# Altium project Current_sence_unit.PrjPcb
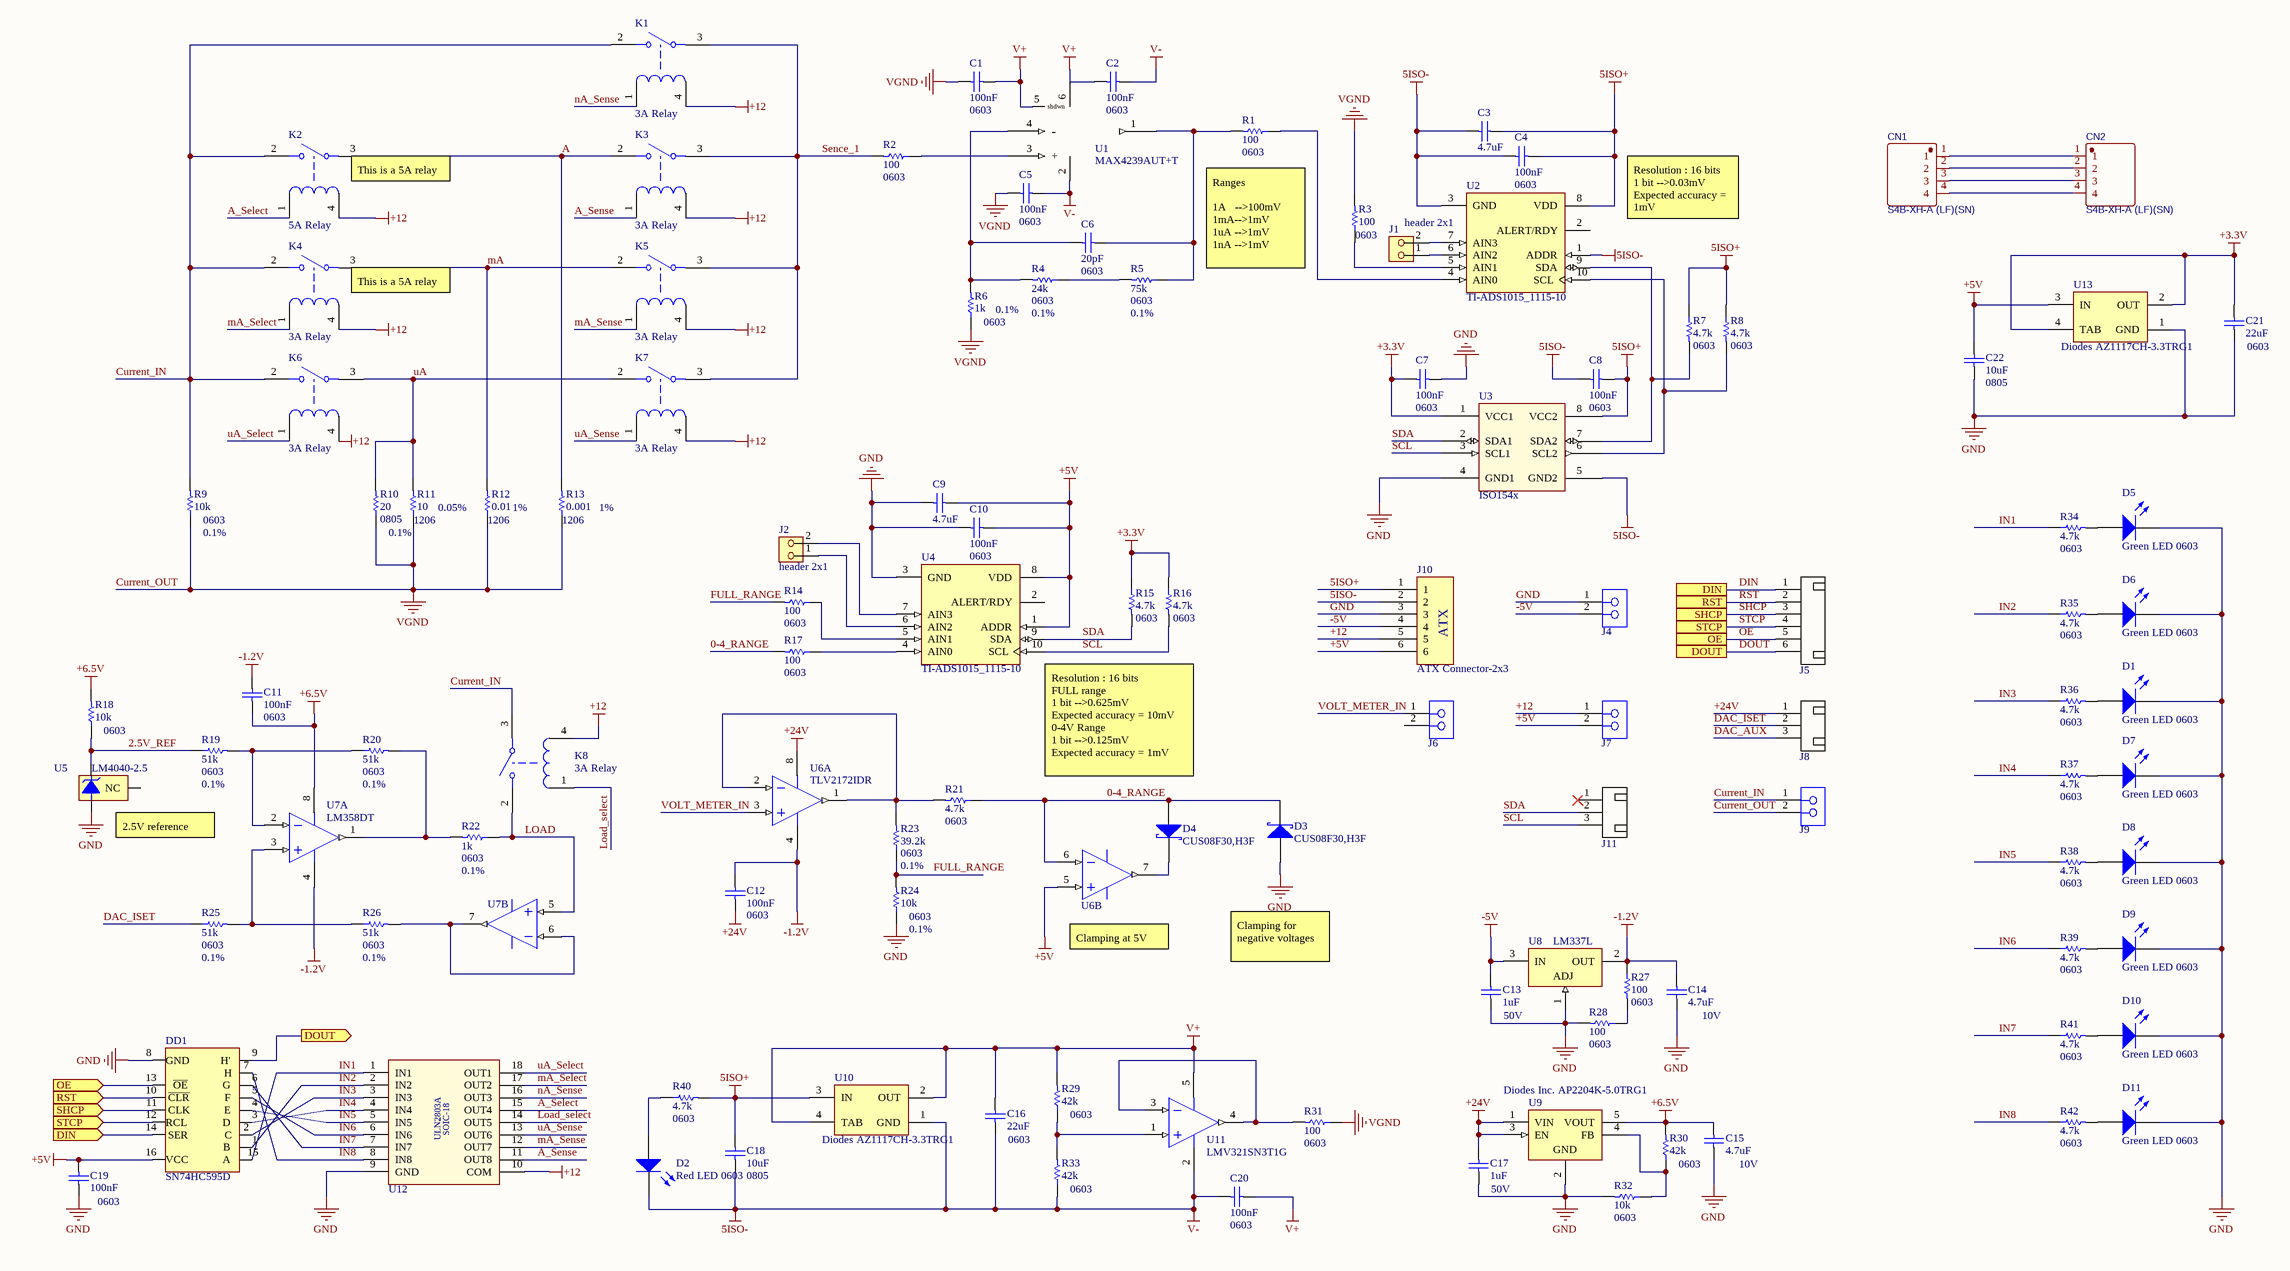
[diagram p0: Current_sence-load-volt_meter.SchDoc]
1 sheet, 109 parts. Net scope: flat (ports and power ports of the same name join across sheets).
Board file: PCB_V1.PcbDoc

## Sheet Current_sence-load-volt_meter.SchDoc
size C

### Parts
C1  100nF  Package / Case: 0603  [CAPC1608X09N]
C2  100nF  Package / Case: 0603  [CAPC1608X09N]
C3  4.7uF  [CAPC1608X09N]
C4  100nF  Package / Case: 0603  [CAPC1608X09N]
C5  100nF  Package / Case: 0603  [CAPC1608X09N]
C6  20pF  Package / Case: 0603  [CAPC1608X09N]
C7  100nF  Package / Case: 0603  [CAPC1608X09N]
C8  100nF  Package / Case: 0603  [CAPC1608X09N]
C9  4.7uF  [CAPC1608X09N]
C10  100nF  Package / Case: 0603  [CAPC1608X09N]
C11  100nF  Package / Case: 0603  [CAPC1608X09N]
C12  100nF  Package / Case: 0603  [CAPC1608X09N]
C13  1uF  Voltage-Rated: 50V  [CAPC1608X09N]
C14  4.7uF  Voltage-Rated: 10V  [CAPC1608X09N]
C15  4.7uF  Voltage-Rated: 10V  [CAPC1608X09N]
C16  22uF  Package / Case: 0603  [CAPC1608X09N]
C17  1uF  Voltage-Rated: 50V  [CAPC1608X09N]
C18  10uF  Package / Case: 0805  [C0805]
C19  100nF  Package / Case: 0603  [CAPC1608X09N]
C20  100nF  Package / Case: 0603  [CAPC1608X09N]
C21  22uF  Package / Case: 0603  [CAPC1608X09N]
C22  10uF  Package / Case: 0805  [C0805]
CN1  S4B-XH-A (LF)(SN)  [CONN-TH_S4B-XH-A (LF)(SN)]
CN2  S4B-XH-A (LF)(SN)  [CONN-TH_S4B-XH-A (LF)(SN)]
D1  Green LED 0603  [0603LED_GEN]
D2  Red LED 0603  [0603LED_GEN]
D3  CUS08F30,H3F  [PCB-7qpkjsjx5cjbarp1o0hc-1]
D4  CUS08F30,H3F  [PCB-7qpkjsjx5cjbarp1o0hc-1]
D5  Green LED 0603  [0603LED_GEN]
D6  Green LED 0603  [0603LED_GEN]
D7  Green LED 0603  [0603LED_GEN]
D8  Green LED 0603  [0603LED_GEN]
D9  Green LED 0603  [0603LED_GEN]
D10  Green LED 0603  [0603LED_GEN]
D11  Green LED 0603  [0603LED_GEN]
DD1  SN74HC595D  [PCB-72k1vk0k27b6qyyenbg0-1]
J1  header 2x1  [PCB-55llon6gpk2h6a06nz0l-1]
J2  header 2x1  [PCB-55llon6gpk2h6a06nz0l-1]
J4  DB126V-5.0-2P-GN  [PCB-kiok1jlp9o9fcwf1wwvf-1]  (value not drawn)
J5  JST S6B-XH-A  [JST S6B-XH-A]  (value not drawn)
J6  DB126V-5.0-2P-GN  [PCB-kiok1jlp9o9fcwf1wwvf-1]  (value not drawn)
J7  DB126V-5.0-2P-GN  [PCB-kiok1jlp9o9fcwf1wwvf-1]  (value not drawn)
J8  CN-1P-M-R3  [JST-S3B-XH-A(LF)(SN)_V]  (value not drawn)
J9  DB126V-5.0-2P-GN  [PCB-kiok1jlp9o9fcwf1wwvf-1]  (value not drawn)
J10  ATX Connector-2x3  [30300060]
J11  CN-1P-M-R3  [JST-S3B-XH-A(LF)(SN)_V]  (value not drawn)
K1  3A Relay  [PCB-ei6nokn2irsc2a7yt94x-1]
K2  5A Relay  [PCB-ei6nokn2irsc2a7yt94x-1]
K3  3A Relay  [PCB-ei6nokn2irsc2a7yt94x-1]
K4  3A Relay  [PCB-ei6nokn2irsc2a7yt94x-1]
K5  3A Relay  [PCB-ei6nokn2irsc2a7yt94x-1]
K6  3A Relay  [PCB-ei6nokn2irsc2a7yt94x-1]
K7  3A Relay  [PCB-ei6nokn2irsc2a7yt94x-1]
K8  3A Relay  [PCB-ei6nokn2irsc2a7yt94x-1]
R1  100  Package / Case: 0603  [gen0603-2]
R2  100  Package / Case: 0603  [gen0603-2]
R3  100  Package / Case: 0603  [gen0603-2]
R4  24k  Package / Case: 0603  Resistance Tolerance: 0.1%  [gen0603-2]
R5  75k  Package / Case: 0603  Resistance Tolerance: 0.1%  [gen0603-2]
R6  1k  Package / Case: 0603  Resistance Tolerance: 0.1%  [gen0603-2]
R7  4.7k  Package / Case: 0603  [gen0603-2]
R8  4.7k  Package / Case: 0603  [gen0603-2]
R9  10k  Package / Case: 0603  Resistance Tolerance: 0.1%  [gen0603-2]
R10  20  Package / Case: 0805  Resistance Tolerance: 0.1%  [PCB-p5gaxfzqzpvl2g018b4o-1]
R11  10  Package / Case: 1206  Resistance Tolerance: 0.05%  [RESC3116X07M]
R12  0.01  Package / Case: 1206  Resistance Tolerance: 1%  [RESC3116X07M]
R13  0.001  Package / Case: 1206  Resistance Tolerance: 1%  [RESC3116X07M]
R14  100  Package / Case: 0603  [gen0603-2]
R15  4.7k  Package / Case: 0603  [gen0603-2]
R16  4.7k  Package / Case: 0603  [gen0603-2]
R17  100  Package / Case: 0603  [gen0603-2]
R18  10k  Package / Case: 0603  [gen0603-2]
R19  51k  Package / Case: 0603  Resistance Tolerance: 0.1%  [gen0603-2]
R20  51k  Package / Case: 0603  Resistance Tolerance: 0.1%  [gen0603-2]
R21  4.7k  Package / Case: 0603  [gen0603-2]
R22  1k  Package / Case: 0603  Resistance Tolerance: 0.1%  [gen0603-2]
R23  39.2k  Package / Case: 0603  Resistance Tolerance: 0.1%  [gen0603-2]
R24  10k  Package / Case: 0603  Resistance Tolerance: 0.1%  [gen0603-2]
R25  51k  Package / Case: 0603  Resistance Tolerance: 0.1%  [gen0603-2]
R26  51k  Package / Case: 0603  Resistance Tolerance: 0.1%  [gen0603-2]
R27  100  Package / Case: 0603  [gen0603-2]
R28  100  Package / Case: 0603  [gen0603-2]
R29  42k  Package / Case: 0603  [gen0603-2]
R30  42k  Package / Case: 0603  [gen0603-2]
R31  100  Package / Case: 0603  [gen0603-2]
R32  10k  Package / Case: 0603  [gen0603-2]
R33  42k  Package / Case: 0603  [gen0603-2]
R34  4.7k  Package / Case: 0603  [gen0603-2]
R35  4.7k  Package / Case: 0603  [gen0603-2]
R36  4.7k  Package / Case: 0603  [gen0603-2]
R37  4.7k  Package / Case: 0603  [gen0603-2]
R38  4.7k  Package / Case: 0603  [gen0603-2]
R39  4.7k  Package / Case: 0603  [gen0603-2]
R40  4.7k  Package / Case: 0603  [gen0603-2]
R41  4.7k  Package / Case: 0603  [gen0603-2]
R42  4.7k  Package / Case: 0603  [gen0603-2]
U1  MAX4239AUT+T  [MF06A_N]
U2  TI-ADS1015_1115-10  [PCB-gqbslbs1r8rxldsn6t09-1]
U3  ISO154x  [SOIC127P600X265-8N]
U4  TI-ADS1015_1115-10  [PCB-gqbslbs1r8rxldsn6t09-1]
U5  LM4040-2.5  [MF03A_N]
U6  TLV2172IDR  [SOIC-OA8_M]  (parts A,B of 2)
U7  LM358DT  [SOIC-OA8_M]  (parts A,B of 2)
U8  LM337L  [Z03A]
U9  Diodes Inc. AP2204K-5.0TRG1  [PCB-iw3p7s72x6qbi5zew47f-1]
U10  Diodes AZ1117CH-3.3TRG1  [PCB-15095235-1]
U11  LMV321SN3T1G  [ONSC-TSOP-5-483-02_V]
U12  ULN2803A (SOIC-18)  [PCB-gcdku7p92m9mz9ih2yin-1]  (value not drawn)
U13  Diodes AZ1117CH-3.3TRG1  [PCB-15095235-1]

### Ports
DIN, DIN (in), DOUT, DOUT (out), OE, OE (in), RST, RST (in), SHCP, SHCP (in), STCP, STCP (in)

### Nets
5ISO+: C3.1 C4.1 C8.2 C18.2 J10.1 R7.1 R8.1 R40.2 U2.8(VDD) U3.8(VCC2) U10.3(IN)
5ISO-: C2.1 C3.2 C4.2 C5.1 C8.1 C16.1 C18.1 C20.2 D2.2(K) J10.2 R33.1 U1.2(V-) U2.1(ADDR) U2.3(GND) U3.5(GND2) U10.1(GND) U11.2(V-)  [also labelled V-]
+3.3V: C7.2 C21.2 R15.1 R16.1 U3.1(VCC1) U13.2(OUT) U13.4(TAB)
+5V: C9.1 C10.1 C19.2 C22.2 DD1.16(VCC) J7.2 J10.6 U4.1(ADDR) U4.8(VDD) U6.5(INB+) U13.3(IN)
+6.5V: C11.2 C15.2 R18.2 R30.2 U7.8(VCC) U9.5(VOUT)
+12: J7.1 J10.5 K1.4 K2.4 K3.4 K4.4 K5.4 K6.4 K7.4 K8.4 U12.10(COM)
+24V: C12.2 C17.2 J8.1 U6.8(VCC) U9.1(VIN) U9.3(EN)
-1.2V: C11.1 C12.1 C14.2 R27.1 U6.4(VEE/GND) U7.4(VEE/GND) U8.2(OUT)
-5V: C13.2 J4.2 J10.4 U8.3(IN)
Current_OUT: C1.2 C5.2 J9.2 R3.2 R6.1 R9.1 R10.1 R11.1 R12.1 R13.1 R31.1  [also labelled VGND]
GND: C7.1 C9.2 C10.2 C13.1 C14.1 C15.1 C17.1 C19.1 C21.1 C22.1 D1.2(K) D3.2(A) D5.2(K) D6.2(K) D7.2(K) D8.2(K) D9.2(K) D10.2(K) D11.2(K) DD1.8(GND) J4.1 J10.3 R24.1 R28.2 R32.2 U3.4(GND1) U4.3(GND) U5.2(-V) U8.1(ADJ) U9.2(GND) U12.9(GND) U13.1(GND)
V+: C1.1 C2.2 C16.2 C20.1 R29.2 U1.5(shdwn) U10.2(OUT) U10.4(TAB) U11.5(V+)
0-4_RANGE: D3.1(K) D4.2(A) R17.2 R21.1 U6.6(INB-)
2.5V_REF: R18.1 R19.1 U5.1(+V)
A: K2.3 K3.2 R13.2
A_Select: K2.1 U12.15(OUT4)
A_Sense: K3.1 U12.11(OUT8)
Current_IN: J9.1 K1.2 K2.2 K4.2 K6.2 K8.3 R9.2
DAC_AUX: J8.3
DAC_ISET: J8.2 R25.1
DIN: DD1.14(SER) J5.1 ; port DIN
DOUT: DD1.9(H') J5.6 ; port DOUT
FULL_RANGE: R14.2 R23.1 R24.2
IN1: DD1.15(A) R34.1 U12.1(IN1)
IN2: DD1.1(B) R35.1 U12.2(IN2)
IN3: DD1.2(C) R36.1 U12.3(IN3)
IN4: DD1.3(D) R37.1 U12.4(IN4)
IN5: DD1.4(E) R38.1 U12.5(IN5)
IN6: DD1.5(F) R39.1 U12.6(IN6)
IN7: DD1.6(G) R41.1 U12.7(IN7)
IN8: DD1.7(H) R42.1 U12.8(IN8)
LOAD: K8.2 R22.1 U7.5(INB+)
Load_select: K8.1 U12.14(OUT5)
mA: K4.3 K5.2 R12.2
mA_Select: K4.1 U12.17(OUT2)
mA_Sense: K5.1 U12.12(OUT7)
nA_Sense: K1.1 U12.16(OUT3)
OE: DD1.13(~{OE}) J5.5 ; port OE
RST: DD1.10(~{CLR}) J5.2 ; port RST
SCL: J11.3 R16.2 U3.3(SCL1) U4.10(SCL)
SDA: J11.2 R15.2 U3.2(SDA1) U4.9(SDA)
Sence_1: K1.3 K3.3 K5.3 K7.3 R2.2
SHCP: DD1.11(CLK) J5.3 ; port SHCP
STCP: DD1.12(RCL) J5.4 ; port STCP
uA: K6.3 K7.2 R10.2 R11.2
uA_Select: K6.1 U12.18(OUT1)
uA_Sense: K7.1 U12.13(OUT6)
VOLT_METER_IN: J6.1 U6.3(INA+)
NetC6_1: C6.1 R1.2 R5.1 U1.1
NetC6_2: C6.2 R4.2 R6.2 U1.4(-)
NetCN1_1: CN1.1 CN2.1
NetCN1_2: CN1.2 CN2.2
NetCN1_3: CN1.3 CN2.3
NetCN1_4: CN1.4 CN2.4
NetD1_1: D1.1(A) R36.2
NetD2_1: D2.1(A) R40.1
NetD4_1: D4.1(K) U6.7(OUTB)
NetD5_1: D5.1(A) R34.2
NetD6_1: D6.1(A) R35.2
NetD7_1: D7.1(A) R37.2
NetD8_1: D8.1(A) R38.2
NetD9_1: D9.1(A) R39.2
NetD10_1: D10.1(A) R41.2
NetD11_1: D11.1(A) R42.2
NetJ1_1: J1.1 U2.6(AIN2)
NetJ1_2: J1.2 U2.7(AIN3)
NetJ2_1: J2.1 U4.6(AIN2)
NetJ2_2: J2.2 U4.7(AIN3)
NetR1_1: R1.1 U2.4(AIN0)
NetR2_1: R2.1 U1.3(+)
NetR3_1: R3.1 U2.5(AIN1)
NetR4_1: R4.1 R5.2
NetR7_2: R7.2 U2.9(SDA) U3.7(SDA2)
NetR8_2: R8.2 U2.10(SCL) U3.6(SCL2)
NetR14_1: R14.1 U4.5(AIN1)
NetR17_1: R17.1 U4.4(AIN0)
NetR19_2: R19.2 R20.1 U7.2(INA-)
NetR20_2: R20.2 R22.2 U7.1(OUTA)
NetR21_2: R21.2 R23.2 U6.1(OUTA) U6.2(INA-)
NetR25_2: R25.2 R26.1 U7.3(INA+)
NetR26_2: R26.2 U7.6(INB-) U7.7(OUTB)
NetR27_2: R27.2 R28.1
NetR29_1: R29.1 R33.2 U11.1(IN+)
NetR30_1: R30.1 R32.1 U9.4(FB)
NetR31_2: R31.2 U11.3(IN-) U11.4(OUT)

Not connected (* = marked no-connect by the designer): J6 2; J11 1*; U1 6(V+); U2 2(ALERT/RDY); U4 2(ALERT/RDY); U5 3(NC)

### Notes on the sheet
- (near K2) This is a 5A relay
- Resolution : 16 bits
  1 bit -->0.03mV
  Expected accuracy = 1mV
- (near K4) This is a 5A relay
- Ranges
  1A   -->100mV
  1mA-->1mV
  1uA -->1mV
  1nA -->1mV
- (near U4) Resolution : 16 bits
  FULL range
  1 bit -->0.625mV
  Expected accuracy = 10mV
  0-4V Range
  1 bit -->0.125mV
  Expected accuracy = 1mV
- (near U5) 2.5V reference
- (near U6) Clamping at 5V
- Clamping for negative voltages
- (in symbol 39600060) ATX
- (in symbol CMP-19353911-22) SOIC-18

### Library data of the parts
C1 C2 C4 C5 C7 C8 C10-C12 C19 C20 = CMP-2f55e5122ad9f092-5: 0603 10 nF 50 V ± 10% Tolerance X7R Surface Mount Multilayer Ceramic Capacitor; Manufacture Part Number: CC0603KRX7R9BB104; Manufacturer: YAGEO; Voltage-Rated: 50V; Capacitance Tolerance: 10%; Capacitance: 100nF; Supplier: LCSC; Supplier Part Number: C14663
C3 C9 = CMP-2f55e5122ad9f092-5: 0603 10 nF 50 V ± 10% Tolerance X7R Surface Mount Multilayer Ceramic Capacitor; Manufacture Part Number: CL10A475KP8NNNC; Manufacturer: Samsung Electro-Mechanics; Voltage-Rated: 10V; Capacitance: 4.7uF; Package / Case: 0603; Supplier: LCSC; Supplier Part Number: C1705; Capacitance Tolerance: 10%
C6 = CMP-2f55e5122ad9f092-5: 0603 10 nF 50 V ± 10% Tolerance X7R Surface Mount Multilayer Ceramic Capacitor; Manufacture Part Number: CC0603JRNPO9BN200; Manufacturer: YAGEO; Voltage-Rated: 50V; Capacitance Tolerance: 5%; Capacitance: 20pF; Supplier: LCSC; Supplier Part Number: C105621
C13 C17 = CMP-2f55e5122ad9f092-5: 0603 10 nF 50 V ± 10% Tolerance X7R Surface Mount Multilayer Ceramic Capacitor; Manufacture Part Number: CL21B105KBFNNNE; Manufacturer: Samsung Electro-Mechanics; Capacitance: 1uF; Package / Case: 0603; Supplier: LCSC; Supplier Part Number: C28323; Capacitance Tolerance: 10%
C14 C15 = CMP-2f55e5122ad9f092-5: 0603 10 nF 50 V ± 10% Tolerance X7R Surface Mount Multilayer Ceramic Capacitor; Manufacture Part Number: CL10A475KP8NNNC; Manufacturer: Samsung Electro-Mechanics; Capacitance: 4.7uF; Package / Case: 0603; Supplier: LCSC; Supplier Part Number: C1705; Capacitance Tolerance: 10%
C16 C21 = CMP-2f55e5122ad9f092-5: 0603 10 nF 50 V ± 10% Tolerance X7R Surface Mount Multilayer Ceramic Capacitor; Manufacture Part Number: CL10A226MP8NUNE; Manufacturer: Samsung Electro-Mechanics; Capacitance Tolerance: 20%; Voltage-Rated: 10V; Capacitance: 22uF; Supplier: LCSC; Supplier Part Number: C86295
C18 C22 = CMP-135114-3: Cap Ceramic 0.1uF 50V X7R 10% SMD 0805 125C Embossed T/R; Manufacture Part Number: CL21B106KOQNNNE; Manufacturer: Samsung Electro-Mechanics; Voltage-Rated: 16V; Capacitance Tolerance: *; Capacitance: 10uF; Supplier: LCSC; Supplier Part Number: C95841
CN1 CN2 = S4B-XH-A (LF)(SN): Manufacturer: JST Sales America; Contributor: LCSC; Supplier: LCSC; Supplier Part Number: C157925; Manufacture Part Number: S4B-XH-A (LF)(SN); spicePre: C; spiceSymbolName: S4B-XH-A (LF)(SN)
D1 D5-D11 = CMP-7ejgl1mi36gtz3spabtw-1: Generic LED 0603; Manufacturer: Orient; Manufacture Part Number: ORH-G36G; Forward Voltage: 2.8V; Color: Green; Supplier: LCSC; Supplier Part Number: C205443
D2 = CMP-7ejgl1mi36gtz3spabtw-1: Generic LED 0603; Manufacturer: Everlight Elec; Manufacture Part Number: 19-217/R6C-AL1M2VY/3T; Forward Voltage: 2V; Color: Red; Supplier: LCSC; Supplier Part Number: C72044
D3 D4 = CMP-df191521a52000de-2: Diode Schottky 30V 2-Pin SOD-323; Manufacturer: TOSHIBA; OctopartID: df191521a52000de; Octopart URL: http://octopart.com/cus08f30%2Ch3f-toshiba-53632863; Manufacture Part Number: CUS08F30,H3F; Supplier Part Number: C150183; Supplier: LCSC
DD1 = CMP-ded317d957220114-5: Shift Register Single 8-Bit Serial to Serial/Parallel 16-Pin SOIC Tube; Manufacture Part Number: 74HC595D,118; Manufacturer: Nexperia; Supplier: LCSC; Supplier Part Number: C5947; Package / Case: SOIC-16_150mil
J1 J2 = Molex 90120-0762-11: 2.54mm (.100") Pitch C-Grid III Header, Single Row, Vertical, 1 Circuits, Gold (Au) Plating; Number of Positions: 2; Lead-Free Status: Lead Free; Voltage Rating (AC): 350.0 V; Current Rating: 3.0 A; Number of Circuits: 1; Gender: Male; Insulation Resistance: 5000000000.0 ?; Contact Resistance: 0.02 ?; Pin Pitch: 0.00254 m; Glow Wire Compliant: Non-Compliant; Octopart URL: http://octopart.com/90120-0762-molex-655414; OctopartID: 8fae46aeaafe5069; Contact Plating: Gold; Packaging: Bag; Contact Material: Brass; Size-Length: 0.00508 m; Lifecycle Status: Not Listed by Manufacturer; Voltage Rating (DC): 350.0 V; Housing Color: Black; Size-Height: 0.0025 m; Housing Material: Plastic; Size-Width: 0.00254 m; Number of Rows: 1; Number of Contacts: 2; Halogen Free Status: Not Reviewed; Orientation: Vertical; Mounting Style: Through Hole, Vertical; RoHS: Compliant
J4 J6 J7 J9 = CMP-7ad9b3d37ed8a51e-5: Block, Terminal; 13.5 A; 250 V; 5 mm; 26 to 16 AWG; 2; Screw; Solder; 4 kV; PA; Manufacturer: DIBO; Pin pitch: 5.0mm; Manufacture Part Number: DB126V-5.0-2P-GN; Supplier: LCSC; Supplier Part Number: C395849
J5 = CMP-239aeae271c2fc5d-12: Socket; wire-board; male; PIN: 6; 2.5mm; THT; XH; 250V; 3A; -25÷85°C; Manufacturer: JST Sales America; Manufacture Part Number: S6B-XH-A(LF)(SN); Lead-Free Status: Lead Free; Voltage Rating (AC): 250 V; Orientation: Right Angle; Supplier: LCSC; Supplier Part Number: C157919
J8 J11 = CMP-656568-19: Male Header, Pitch 2.5 mm, 1 x 3 Position, Height 6.1 mm, Tail Length 3.4 mm, -25 to 85 degC, RoHS, Bulk; Manufacture Part Number: S3B-XH-A(LF)(SN); Manufacturer: JST Sales America; Number of Contacts: 3; Current Rating: 3.00 A; Lead-Free Status: Lead Free; Insulation Resistance: 1.00 GΩ; RoHS: Compliant; PackageDescription: Male Header, Pitch 2.5 mm, 1 x 3 Position, Height 6.1 mm, Tail Length 3.4 mm; Gender: Male; Mounting Style: Through Hole; PackageReference: S3B-XH-A(LF)(SN); Supplier Part Number: C157928; Supplier: LCSC
J10 = 39600060: Connector Header Through Hole, Right Angle 6 position 0.165" (4.20mm); Manufacturer: BOOMELE(Boom Precision Elec); Manufacture Part Number: 5557-2*3AW; Pin Pitch: 4.2mm; Supplier: LCSC; Supplier Part Number: C54904
K1 K3-K8 = CMP-edc624afa9603201-3: Power Relay 12VDC 3DC/5AAC SPST-NO( (20.5mm 7.2mm 15.3mm)) THT; Manufacturer: Omron Electronics; Manufacture Part Number: G5NB-1A-E-DC12; Supplier: LCSC; Supplier Part Number: C225714; Current-Rated: 3A
K2 = CMP-edc624afa9603201-3: General Purpose Non Latching 12VDC SPST-NO 5A Through Hole Relays RoHS; Manufacturer: HF(Xiamen Hongfa Electroacoustic); Manufacture Part Number: HF46F/12-HS1; Supplier: LCSC; Supplier Part Number: C3636; Current-Rated: 5A
R1-R3 R14 R17 R27 R28 R31 = CMP-1853278-27: Surface Mount Thick Film Resistor, RC Series, 1 kohm, 100 mW, - 1%, 50 V, 0603 [1608 Metric]; Manufacture Part Number: 0603WAF1000T5E; Manufacturer: UNI-ROYAL(Uniroyal Elec); Resistance: 100; Resistance Tolerance: 1%; Supplier: LCSC; Supplier Part Number: C22775
R4 = CMP-1853278-27: Surface Mount Thick Film Resistor, RC Series, 1 kohm, 100 mW, - 1%, 50 V, 0603 [1608 Metric]; Manufacture Part Number: ERJPB3B2402V; Manufacturer: PANASONIC; Resistance: 24k; Supplier: LCSC; Supplier Part Number: C413706
R5 = CMP-1853278-27: Surface Mount Thick Film Resistor, RC Series, 1 kohm, 100 mW, - 1%, 50 V, 0603 [1608 Metric]; Manufacture Part Number: ERJPB3B7502V; Manufacturer: PANASONIC; Resistance: 75k; Supplier: LCSC; Supplier Part Number: C413688
R6 R22 = CMP-1853278-27: Surface Mount Thick Film Resistor, RC Series, 1 kohm, 100 mW, - 1%, 50 V, 0603 [1608 Metric]; Manufacture Part Number: ERJPB3B1001V; Manufacturer: PANASONIC; Resistance: 1k; Supplier: LCSC; Supplier Part Number: C193680
R7 R8 R15 R16 R21 R34-R42 = CMP-1853278-27: Surface Mount Thick Film Resistor, RC Series, 1 kohm, 100 mW, - 1%, 50 V, 0603 [1608 Metric]; Manufacture Part Number: RC0603FR-074K7L; Manufacturer: YAGEO; Resistance: 4.7k; Resistance Tolerance: 1%; Supplier: LCSC; Supplier Part Number: C99782
R9 R24 = CMP-1853278-27: Surface Mount Thick Film Resistor, RC Series, 1 kohm, 100 mW, - 1%, 50 V, 0603 [1608 Metric]; Manufacture Part Number: WF06Q1002BTL; Manufacturer: Walsin Tech Corp; Resistance: 10k; Supplier: LCSC; Supplier Part Number: C305259
R10 = CMP-f2923ac3d6042d55-1: Res Thin Film 0805 4.99 Ohm 0.1% 1/8W ±15ppm/°C Molded SMD SMD Paper T/R; Manufacture Part Number: MCWF08U20R0BTL; Manufacturer: Multicomp; Resistance: 20; Supplier: LCSC; Supplier Part Number: C241306
R11 R12 = CMP-90ca5a8d69034f0d-5: Res Thick Film 3.2 x 1.6 mm 10K Ohm 1% 0.25W(1/4W) 100ppm/ C Molded SMD Paper T/R; Manufacture Part Number: PE1206FKE470R01Z; Manufacturer: YAGEO; Supplier: LCSC; Supplier Part Number: C364375
  R11: Resistance: 10
  R12: Resistance: 0.01
R13 = CMP-90ca5a8d69034f0d-5: Res Thick Film 3.2 x 1.6 mm 10K Ohm 1% 0.25W(1/4W) 100ppm/ C Molded SMD Paper T/R; Manufacture Part Number: MA120610FR001SZ; Manufacturer: Ever Ohms Tech; Resistance: 0.001; Supplier: LCSC; Supplier Part Number: C429334
R18 R32 = CMP-1853278-27: Surface Mount Thick Film Resistor, RC Series, 1 kohm, 100 mW, - 1%, 50 V, 0603 [1608 Metric]; Manufacture Part Number: RC0603FR-0710KL; Manufacturer: YAGEO; Resistance: 10k; Resistance Tolerance: 1%; Supplier: LCSC; Supplier Part Number: C98220
R19 R20 R25 R26 = CMP-1853278-27: Surface Mount Thick Film Resistor, RC Series, 1 kohm, 100 mW, - 1%, 50 V, 0603 [1608 Metric]; Manufacture Part Number: ERJPB3B5102V; Manufacturer: PANASONIC; Resistance: 51k; Supplier: LCSC; Supplier Part Number: C413694
R23 = CMP-1853278-27: Surface Mount Thick Film Resistor, RC Series, 1 kohm, 100 mW, - 1%, 50 V, 0603 [1608 Metric]; Manufacture Part Number: ERA3AEB3922V; Manufacturer: PANASONIC; Resistance: 39.2k; Supplier: LCSC; Supplier Part Number: C491129
R29 R30 R33 = CMP-1853278-27: Surface Mount Thick Film Resistor, RC Series, 1 kohm, 100 mW, - 1%, 50 V, 0603 [1608 Metric]; Manufacture Part Number: 0603WAF4222T5E; Manufacturer: UNI-ROYAL(Uniroyal Elec); Resistance: 42k; Resistance Tolerance: 1%; Supplier: LCSC; Supplier Part Number: C23167
U1 = CMP-250bee9e4f44facc-2: OP Amp Single GP R-R O/P 5.5V 6-Pin SOT-23 T/R; Manufacturer: Maxim Integrated; Bandwidth: 6.50 MHz; Slew Rate: 1.60 V/μs; RoHS: Compliant; Number of Pins: 6; Packaging: Cut Tape (CT); Octopart URL: http://octopart.com/max4239aut%2Bt-maxim+integrated-43994921; Manufacture Part Number: MAX4239AUT+T; Lifecycle Status: Not Listed by Manufacturer; OctopartID: 250bee9e4f44facc; Supplier: utsource
U2 U4 = CMP-19361522-7: Quad Channel Single ADC Delta-Sigma 860sps 16-bit Serial 10-Pin VSSOP T/R; Manufacturer: Texas Instruments; Manufacture Part Number: ADS1115IDGST; Power Consumption: 360 µW; Number of Bits: 16; Supply Voltage (DC): 5.50 V (max), 2.00 V (min); OctopartID: 7248bbf0cbd1ad8f; Packaging: Tape & Reel (TR), Reel, Cut Tape (CT); Number of Pins: 10; Supplier: utsource
U3 = CMP-4359179-9: Low-Power, Bidirectional I2C Isolators 8-SOIC -40 to 125; Manufacture Part Number: ISO1541DR; Manufacturer: Texas Instruments; Data Rate: 1000000.0 bps; Supply Voltage (DC): 3 to 5.5 V; Lead-Free Status: Lead Free; Number of Channels: 2; Octopart URL: http://octopart.com/iso1541dr-texas+instruments-24334115; Lifecycle Status: Active; Number of Pins: 8; RoHS: Compliant; OctopartID: 6027a85e0a62bfe0; Case/Package: SOIC; Supplier: LCSC; Supplier Part Number: C143028
U5 = LM4040CEM3-2.5/NOPB: Precision Micropower Shunt Voltage Reference, 3-pin SOT-23, Pb-Free; Manufacture Part Number: LM4040D25FTA; Manufacturer: Diodes Incorporated; Lead-Free Status: Lead Free; Output Current: 0.015 A; Output Voltage: 2.5 V; Lifecycle Status: Active; Mounting Style: Surface Mount; Number of Pins: 3; Octopart Url: https://octopart.com/lm4040cem3-2.5%2Fnopb-texas+instruments-24814254; OctopartID: 26c2eeb2a10af905; Packaging: Tape & Reel (TR); REACH SVHC Compliance: No SVHC; RoHS: Compliant; Supplier Part Number: C107244; Supplier: LCSC
U6 = CMP-9a3c516d515145fb-3: General Purpose 2 4.5V ~ 36V, ±2.25V ~ 18V 10MHz 10 V/us SOIC-8_150mil General Purpose Amplifiers RoHS; Manufacturer: Texas Instruments; Slew Rate: 600 mV/μs; Number of Channels: 2; Gain Bandwidth Product: 1.10 MHz; Supply Current: 700 µA; Lead-Free Status: Lead Free; Supply Voltage (DC): 32.0 V; Lifecycle Status: Active; Manufacture Part Number: TLV2172IDR; REACH SVHC Compliance: No SVHC; RoHS: Compliant; Number of Pins: 8; Bandwidth: 1.10 MHz; Number of Circuits: 2; Packaging: Cut Tape (CT), Tape & Reel (TR); Mounting Style: Surface Mount; Case/Package: SOIC; Supplier Part Number: C129149; Supplier: LCSC
U7 = CMP-9a3c516d515145fb-3: LM358 Series 30 V 1.1 MHz Low Power Dual Operational Amplifier - SOIC-8; Manufacturer: STMicroelectronics; Slew Rate: 600 mV/μs; Number of Channels: 2; Gain Bandwidth Product: 1.10 MHz; Supply Current: 700 µA; Lead-Free Status: Lead Free; Supply Voltage (DC): 32.0 V; Lifecycle Status: Active; REACH SVHC Compliance: No SVHC; Octopart URL: https://octopart.com/lm358dt-stmicroelectronics-39579147; RoHS: Compliant; Number of Pins: 8; Bandwidth: 1.10 MHz; Number of Circuits: 2; Packaging: Cut Tape (CT), Tape & Reel (TR); Mounting Style: Surface Mount; Case/Package: SOIC; OctopartID: 9a3c516d515145fb; Supplier Part Number: C9418; Supplier: LCSC; Manufacture Part Number: LM358DT
U8 = LM337LZ/NOPB: 3-Terminal Adjustable Regulator, 3-pin TO-92, Pb-Free; Manufacturer: Texas Instruments; Current Rating: 1.0 A; Dropout Voltage: 0.003 V; Lead-Free Status: Lead Free; Number of Outputs: 1; Output Current: 0.1 A; Case/Package: SOIC; Lifecycle Status: Active; Mounting Style: Through Hole; Number of Pins: 3; Number of Regulated Outputs: 1; Octopart Url: https://octopart.com/lm337lz%2Fnopb-texas+instruments-24813737; OctopartID: cd28055848e712ef; Packaging: Box; REACH SVHC Compliance: No SVHC; RoHS: Compliant; Manufacture Part Number: LM337LZ/NOPB; Supplier: LCSC; Supplier Part Number: C33082
U9 = CMP-6ce4a4361dffb323-1: LDO voltage regulator [Diodes Incorporated] AP2204K-5.0TRG1 LDO voltage regulator; Manufacture Part Number: AP2204K-ADJTRG1; Lead-Free Status: Lead Free; Mounting Style: Surface Mount; Manufacturer: Diodes Incorporated; Supplier: LCSC; Supplier Part Number: C264072; Package: SOT-23-5
U10 U13 = CMP-15095235-4: IC REG LDO 3.3V 0.8A SOT223; Manufacturer: Diodes Incorporated; Lead-Free Status: Lead Free; OctopartID: a6d46e06d6807913; Octopart Url: https://octopart.com/az1117ch-3.3trg1-diodes+inc.-30954802; Lifecycle Status: Not Listed by Manufacturer; RoHS: Compliant; Manufacture Part Number: AZ1117CH-3.3TRG1; Supplier Part Number: C92102; Supplier: LCSC
U11 = CMP-1330714-2: Single Low-Voltage, Rail-to-Rail Operational Amplifier, 2.7 to 5.5 V, -40 to 85 degC, 5-Pin TSOP, Pb-Free, Tape and Reel; Manufacturer: Gainsil; Manufacture Part Number: LMV321-TR; Lead-Free Status: Lead Free; Lifecycle Status: Active; Supplier: LCSC; Supplier Part Number: C362273; RoHS: Compliant
U12 = CMP-19353911-22: Bipolar (BJT) Array Transistor, Darlington, NPN, 50 V, 500 mA, SOIC; Manufacturer: Mixic; Manufacture Part Number: ULN2803A; Supplier: LCSC; Supplier Part Number: C107219; Package / Case: SOP-18_300mil